# Altium schematic sheet T35_3_POWERSUPPLY.SchDoc
size A3
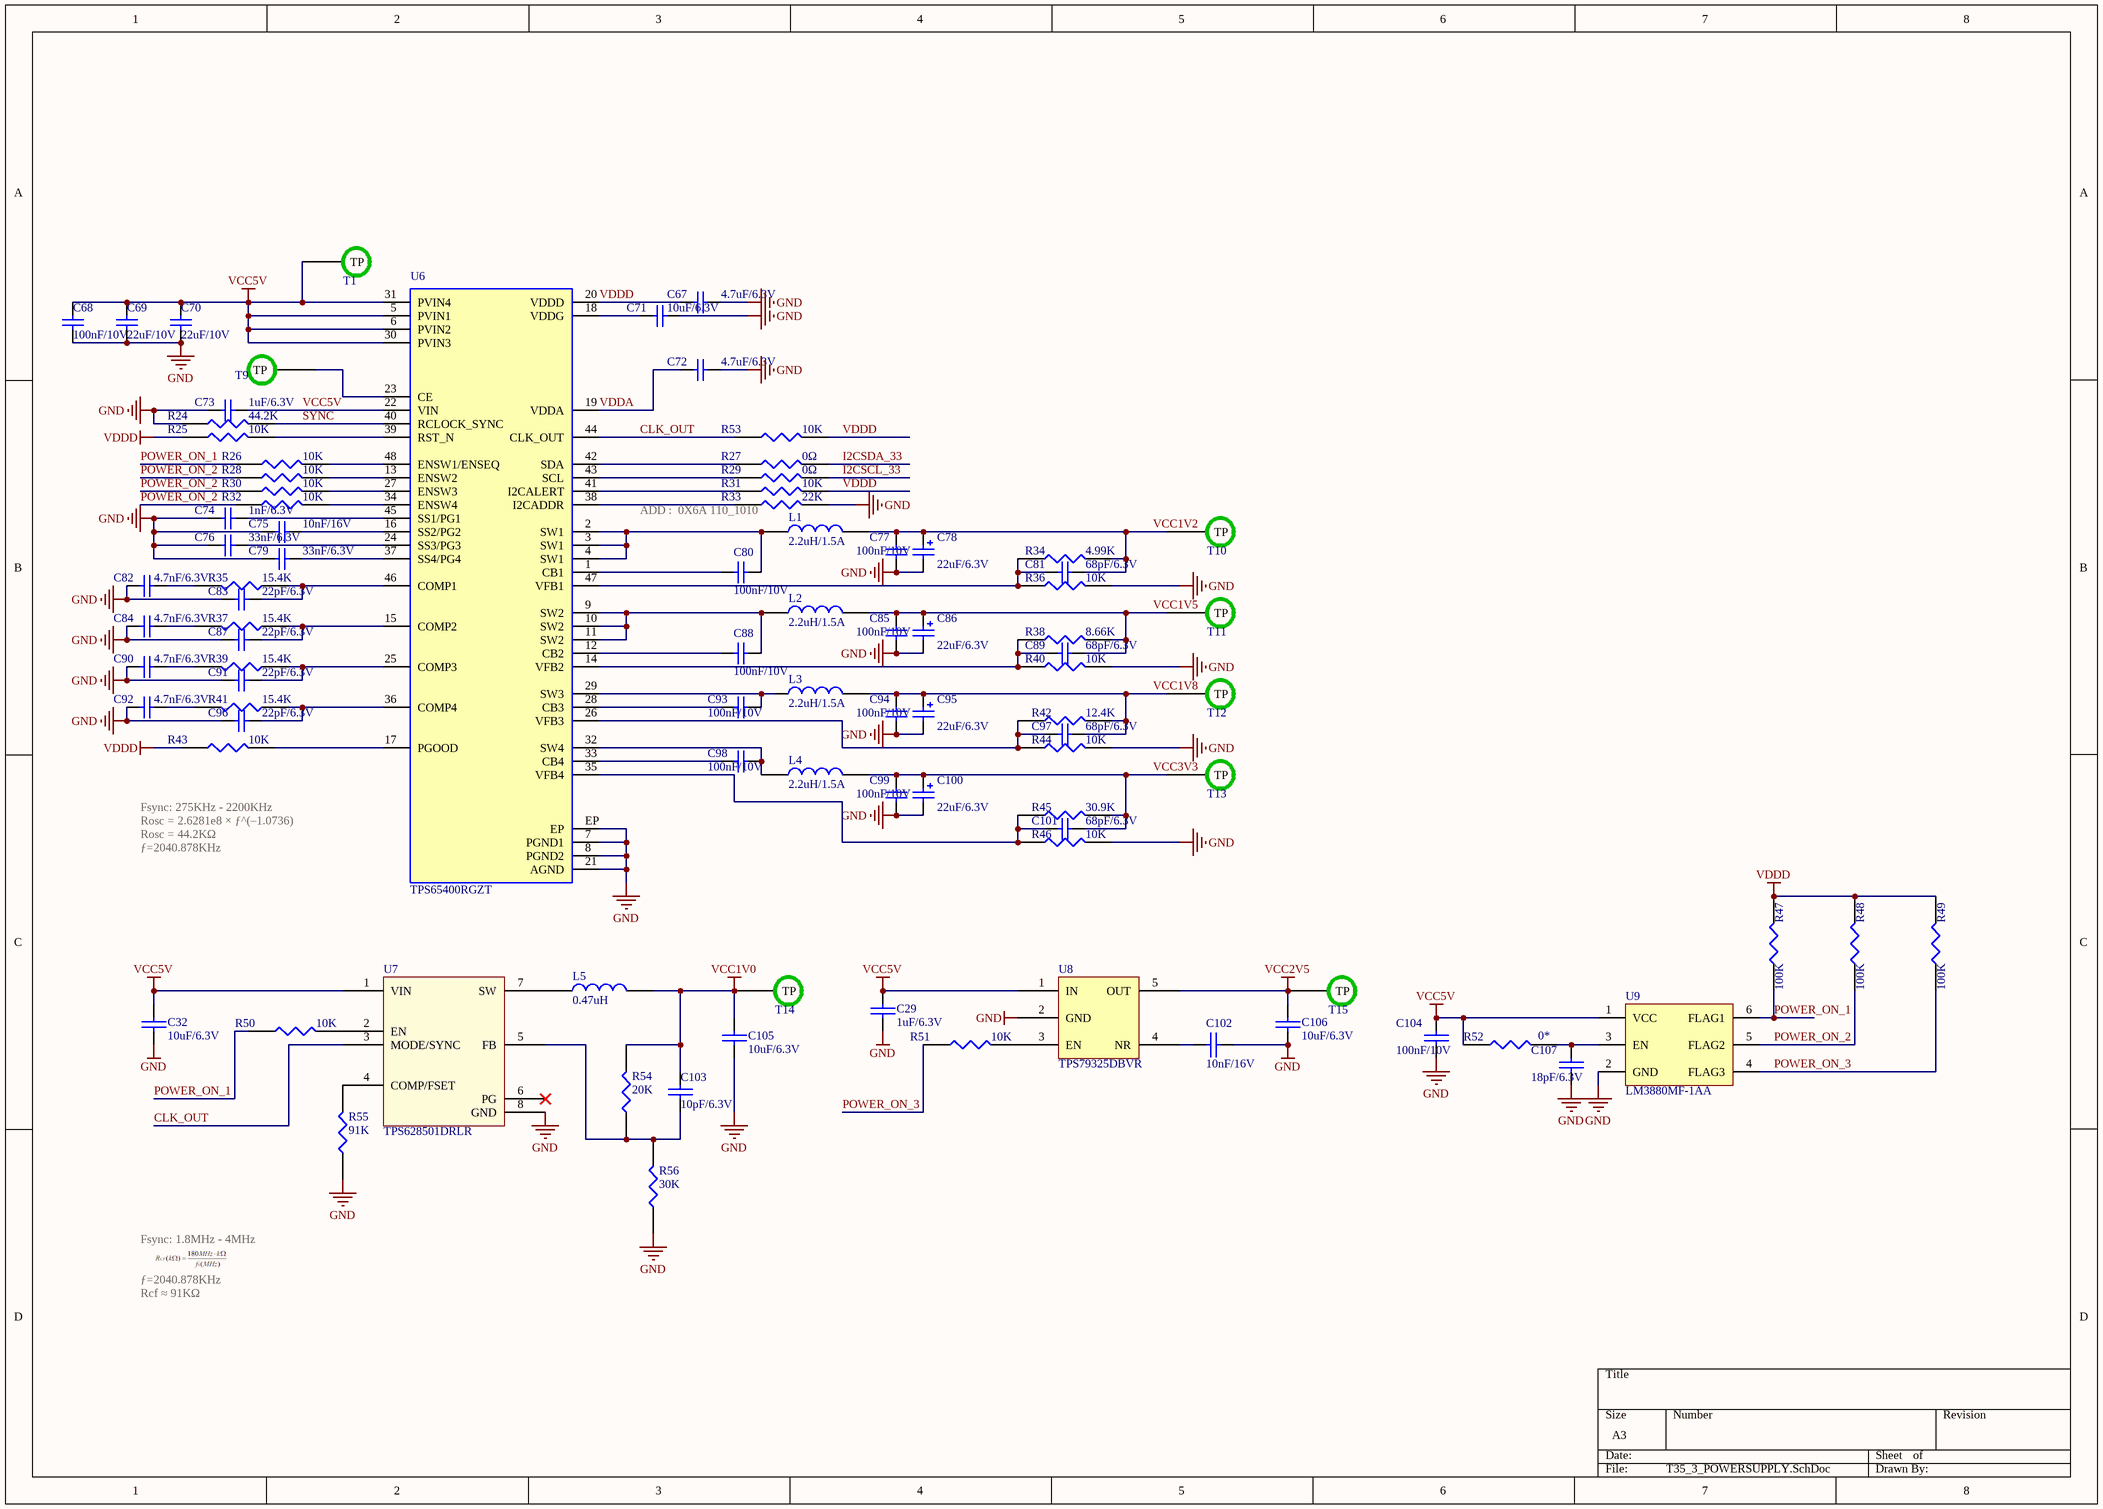
[diagram p0: T35_3_POWERSUPPLY.SchDoc]

## Parts
C29  1uF/6.3V  [0201CS]
C32  10uF/6.3V  [0402CS]
C67  4.7uF/6.3V  [0402CS]
C68  100nF/10V  [0201CS]
C69  22uF/10V  [0603CS]
C70  22uF/10V  [0603CS]
C71  10uF/6.3V  [0402CS]
C72  4.7uF/6.3V  [0402CS]
C73  1uF/6.3V  [0201CS]
C74  1nF/6.3V  [0201CS]
C75  10nF/16V  [0201CS]
C76  33nF/6.3V  [0201CS]
C77  100nF/10V  [0201CS]
C78  22uF/6.3V  [0603CS]
C79  33nF/6.3V  [0201CS]
C80  100nF/10V  [0201CS]
C81  68pF/6.3V  [0201CS]
C82  4.7nF/6.3V  [0201CS]
C83  22pF/6.3V  [0201CS]
C84  4.7nF/6.3V  [0201CS]
C85  100nF/10V  [0201CS]
C86  22uF/6.3V  [0603CS]
C87  22pF/6.3V  [0201CS]
C88  100nF/10V  [0201CS]
C89  68pF/6.3V  [0201CS]
C90  4.7nF/6.3V  [0201CS]
C91  22pF/6.3V  [0201CS]
C92  4.7nF/6.3V  [0201CS]
C93  100nF/10V  [0201CS]
C94  100nF/10V  [0201CS]
C95  22uF/6.3V  [0603CS]
C96  22pF/6.3V  [0201CS]
C97  68pF/6.3V  [0201CS]
C98  100nF/10V  [0201CS]
C99  100nF/10V  [0201CS]
C100  22uF/6.3V  [0603CS]
C101  68pF/6.3V  [0201CS]
C102  10nF/16V  [0201CS]
C103  10pF/6.3V  [0201CS]
C104  100nF/10V  [0201CS]
C105  10uF/6.3V  [0402CS]
C106  10uF/6.3V  [0402CS]
C107  18pF/6.3V  [0201CS]
L1  2.2uH/1.5A  [201610]
L2  2.2uH/1.5A  [201610]
L3  2.2uH/1.5A  [201610]
L4  2.2uH/1.5A  [201610]
L5  0.47uH  [201610]
R24  44.2K  [0201RS]
R25  10K  [0201RS]
R26  10K  [0201RS]
R27  0Ω  [0201RS]
R28  10K  [0201RS]
R29  0Ω  [0201RS]
R30  10K  [0201RS]
R31  10K  [0201RS]
R32  10K  [0201RS]
R33  22K  [0201RS]
R34  4.99K  [0201RS]
R35  15.4K  [0201RS]
R36  10K  [0201RS]
R37  15.4K  [0201RS]
R38  8.66K  [0201RS]
R39  15.4K  [0201RS]
R40  10K  [0201RS]
R41  15.4K  [0201RS]
R42  12.4K  [0201RS]
R43  10K  [0201RS]
R44  10K  [0201RS]
R45  30.9K  [0201RS]
R46  10K  [0201RS]
R47  100K  [0201RS]
R48  100K  [0201RS]
R49  100K  [0201RS]
R50  10K  [0201RS]
R51  10K  [0201RS]
R52  0*  [0201RS]
R53  10K  [0201RS]
R54  20K  [0201RS]
R55  91K  [0201RS]
R56  30K  [0201RS]
T1  (no value)  [TP-S]
T9  (no value)  [TP-S]
T10  (no value)  [TP-S]
T11  (no value)  [TP-S]
T12  (no value)  [TP-S]
T13  (no value)  [TP-S]
T14  (no value)  [TP-S]
T15  (no value)  [TP-S]
U6  TPS65400RGZT  [QFN50P700X700X100-49N_TPS65400RGZT(Primary)]
U7  TPS628501DRLR  [SOT583]
U8  TPS79325DBVR  [SOT-23-5]
U9  LM3880MF-1AA  [SOT-23-6]

## Nets
GND: C29.2 C32.2 C67.2 C68.1 C69.1 C70.1 C71.2 C72.2 C73.1 C74.1 C75.1 C76.1 C77.1 C78.2 C79.1 C82.2 C83.2 C84.2 C85.1 C86.2 C87.2 C90.2 C91.2 C92.2 C94.1 C95.2 C96.2 C99.1 C100.2 C102.2 C104.2 C105.2 C106.2 C107.2 R24.1 R33.2 R36.2 R40.2 R44.2 R46.2 R55.1 R56.1 U6.7(PGND1) U6.8(PGND2) U6.21(AGND) U6.EP U7.8(GND) U8.2(GND) U9.2(GND)
VCC1V0: C103.1 C105.1 L5.2 R54.2 T14.1(TP)
VCC2V5: C106.1 T15.1(TP) U8.5(OUT)
VCC5V: C29.1 C32.1 C68.2 C69.2 C70.2 C73.2 C104.1 R52.1 T1.1(TP) U6.5(PVIN1) U6.6(PVIN2) U6.22(VIN) U6.30(PVIN3) U6.31(PVIN4) U7.1(VIN) U8.1(IN) U9.1(VCC)
VDDD: C67.1 R25.1 R31.2 R43.1 R47.2 R48.2 R49.2 R53.2 U6.20(VDDD)
CLK_OUT: R53.1 U6.44(CLK_OUT) U7.3(MODE/SYNC)
I2CSCL_33: R29.2
I2CSDA_33: R27.2
POWER_ON_1: R26.1 R47.1 R50.1 U9.6(FLAG1)
POWER_ON_2: R28.1 R30.1 R32.1 R48.1 U9.5(FLAG2)
POWER_ON_3: R49.1 R51.1 U9.4(FLAG3)
SYNC: R24.2 U6.40(RCLOCK_SYNC)
VCC1V2: C77.2 C78.1 C81.1 L1.2 R34.2 T10.1(TP)
VCC1V5: C85.2 C86.1 C89.1 L2.2 R38.2 T11.1(TP)
VCC1V8: C94.2 C95.1 C97.1 L3.2 R42.2 T12.1(TP)
VCC3V3: C99.2 C100.1 C101.1 L4.2 R45.2 T13.1(TP)
VDDA: C72.1 U6.19(VDDA)
NetC71_1: C71.1 U6.18(VDDG)
NetC74_2: C74.2 U6.45(SS1/PG1)
NetC75_2: C75.2 U6.16(SS2/PG2)
NetC76_2: C76.2 U6.24(SS3/PG3)
NetC79_2: C79.2 U6.37(SS4/PG4)
NetC80_1: C80.1 L1.1 U6.2(SW1) U6.3(SW1) U6.4(SW1)
NetC80_2: C80.2 U6.1(CB1)
NetC81_2: C81.2 R34.1 R36.1 U6.47(VFB1)
NetC82_1: C82.1 R35.2
NetC83_1: C83.1 R35.1 U6.46(COMP1)
NetC84_1: C84.1 R37.2
NetC87_1: C87.1 R37.1 U6.15(COMP2)
NetC88_1: C88.1 L2.1 U6.9(SW2) U6.10(SW2) U6.11(SW2)
NetC88_2: C88.2 U6.12(CB2)
NetC89_2: C89.2 R38.1 R40.1 U6.14(VFB2)
NetC90_1: C90.1 R39.2
NetC91_1: C91.1 R39.1 U6.25(COMP3)
NetC92_1: C92.1 R41.2
NetC93_1: C93.1 L3.1 U6.29(SW3)
NetC93_2: C93.2 U6.28(CB3)
NetC96_1: C96.1 R41.1 U6.36(COMP4)
NetC97_2: C97.2 R42.1 R44.1 U6.26(VFB3)
NetC98_1: C98.1 L4.1 U6.32(SW4)
NetC98_2: C98.2 U6.33(CB4)
NetC101_2: C101.2 R45.1 R46.1 U6.35(VFB4)
NetC102_1: C102.1 U8.4(NR)
NetC103_2: C103.2 R54.1 R56.2 U7.5(FB)
NetC107_1: C107.1 R52.2 U9.3(EN)
NetL5_1: L5.1 U7.7(SW)
NetR25_2: R25.2 U6.39(RST_N)
NetR26_2: R26.2 U6.48(ENSW1/ENSEQ)
NetR27_1: R27.1 U6.42(SDA)
NetR28_2: R28.2 U6.13(ENSW2)
NetR29_1: R29.1 U6.43(SCL)
NetR30_2: R30.2 U6.27(ENSW3)
NetR31_1: R31.1 U6.41(I2CALERT)
NetR32_2: R32.2 U6.34(ENSW4)
NetR33_1: R33.1 U6.38(I2CADDR)
NetR43_2: R43.2 U6.17(PGOOD)
NetR50_2: R50.2 U7.2(EN)
NetR51_2: R51.2 U8.3(EN)
NetR55_2: R55.2 U7.4(COMP/FSET)
NetT9_1: T9.1(TP) U6.23(CE)

Not connected (* = marked no-connect by the designer): U7 6(PG)*

## Notes on the sheet
- (near R33) ADD :  0X6A 110_1010
- Fsync: 275KHz - 2200KHz
- Rosc = 2.6281e8 × ƒ^(–1.0736)
- Rosc = 44.2KΩ
- ƒ=2040.878KHz
- Fsync: 1.8MHz - 4MHz
- Rcf ≈ 91KΩ

## Library data of the parts
C29 C32 C102 C103 C105 C106 = CAP: 贴片电容
  C29: Link: https://item.szlcsc.com/54083.html
  C102: Link: https://item.szlcsc.com/78065.html
C67 C72 = 0402 100nF (104) 10% 16V: 贴片电容; Value: 4.7uF ±10% 16V; Link: https://item.szlcsc.com/3277786.html
C68-C70 C77 C80 C85 C88 C93 C94 C98 C99 = 0402 100nF (104) 10% 16V: 贴片电容
  C68 C77 C80 C85 C88 C93 C94 C98 C99: Link: https://item.szlcsc.com/456838.html
  C69 C70: Link: https://item.szlcsc.com/315294.html
C71 = 0402 100nF (104) 10% 16V: 贴片电容; Value: 10uF ±10% 25V
C73 = 0402 100nF (104) 10% 16V: 贴片电容; Value: 1uF  ±10% 25V; Link: https://item.szlcsc.com/54083.html
C74 = 0402 100nF (104) 10% 16V: 贴片电容; Value: 1nF,±10% 50V
C75 = 0402 100nF (104) 10% 16V: 贴片电容; Value: 10nF,±10% 50V; ComponentLink1Description: Link; ComponentLink1URL: https://item.szlcsc.com/78065.html
C76 C79 = 0402 100nF (104) 10% 16V: 贴片电容; Value: 33nF,±10% 50V
C78 C86 C95 C100 = 3216 10uF (106) 10% 16V: 贴片电容; Link: https://item.szlcsc.com/60514.html
C81 C89 C97 C101 = 0402 100nF (104) 10% 16V: 贴片电容; Value: 68pF,±10% 16V
C82 C84 C90 C92 = 0402 100nF (104) 10% 16V: 贴片电容; Value: 4.7nF,±10% 16V
C83 C91 = 0402 100nF (104) 10% 16V: 贴片电容; Value: 22pF,±5% 50V
C87 C96 = 0402 100nF (104) 10% 16V: 贴片电容; Value: 22pF,±10% 16V
C104 = CAP: 贴片电容; Value: 0.1uF ±10% 16V; ComponentLink1Description: Link; ComponentLink1URL: https://item.szlcsc.com/456838.html
C107 = CAP: 贴片电容; Value: 18pF ±5% 50V
L1-L4 = INDUCTOR: 功率电感; Link: https://item.szlcsc.com/271084.html
L5 = INDUCTOR: 功率电感; PartNumber: BDCD00201610R47MS1; Link: https://item.szlcsc.com/3012718.html
R24 R55 = RES1: 贴片电阻; Value: 330K,±1%
R25 R26 R28 R30-R33 R36 R40 R43 R44 R46 R50 R51 R53 R54 R56 = RES1: 贴片电阻; Value: 10K,±1%
R27 R29 = RES1: 贴片电阻; Value: 0Ω,±1%
R34 = RES1: 贴片电阻; Value: 1.24K,±1%
R35 R37 R39 R41 = RES1: 贴片电阻; Value: 15.4K,±1%
R38 = RES1: 贴片电阻; Value: 19.1K,±1%
R42 = RES1: 贴片电阻; Value: 53.6K,±1%
R45 = RES1: 贴片电阻; Value: 8.66K,±1%
R47-R49 = RES1: 贴片电阻; Value: 100K，±1%
R52 = RES1: 贴片电阻; Value: 0Ω，±5%
T1 T9-T15 = TP: 测试点; Value: 测试点
U6 = TPS65400RGZT: 电源芯片; MF: Texas Instruments; Value: TPS65400RGZT; SnapEDA_Link: https://www.snapeda.com/parts/TPS65400RGZT/Texas%20Instruments/view-part/?ref=snap; Availability: Good; Price: 3.95 USD; Package: VQFN-48 Texas Instruments; MP: TPS65400RGZT
U7 = TPS628501: 电源芯片
U8 = TPS793-XX: 电源芯片
U9 = LM3880MF-1AA: 时序排序器; Value: LM3880MF-1AA